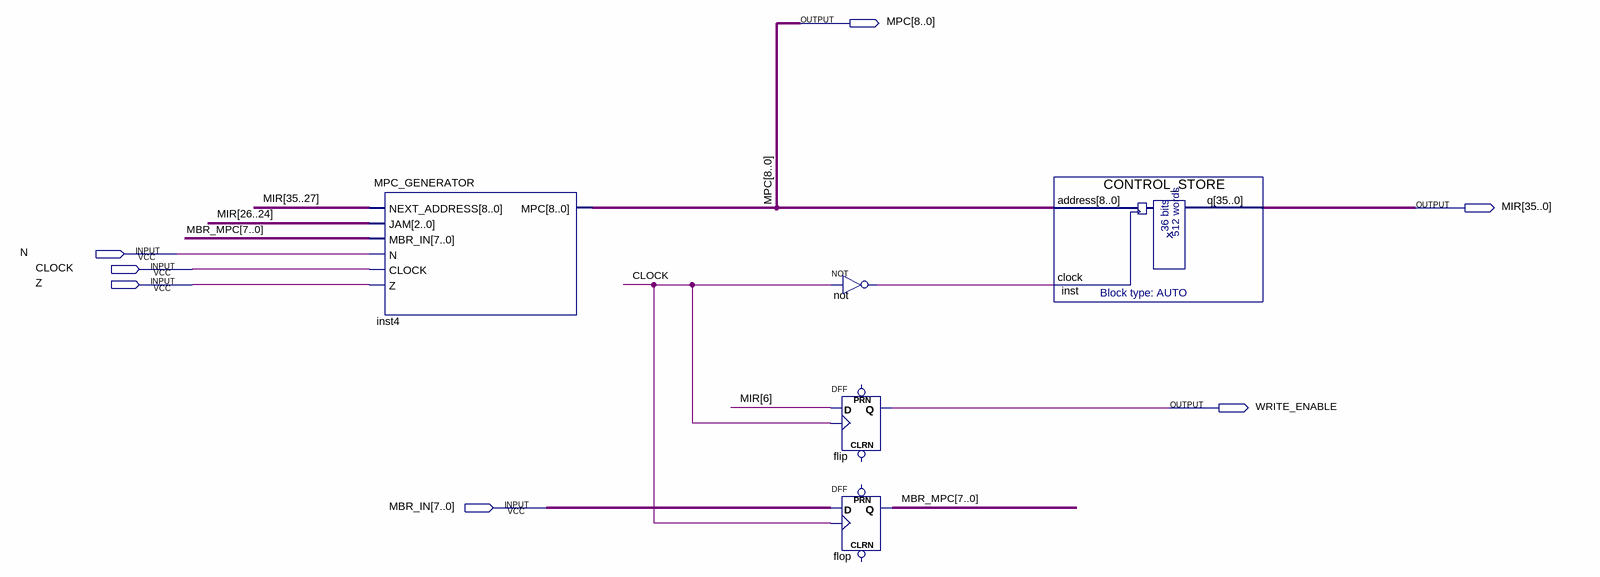
[diagram p0: schematic sheet]
// Quartus schematic CONTROL_UNIT.bdf as structural Verilog: 5 symbols, 7 pins
module CONTROL_UNIT (
  input  N,
  input  CLOCK,
  input  Z,
  input  [7:0] MBR_IN,
  output [8:0] MPC,
  output [35:0] MIR,
  output WRITE_ENABLE
);

  wire not_out;
  wire [7:0] MBR_MPC;

  MPC_GENERATOR inst4 (
    .NEXT_ADDRESS(MIR[35:27]), .JAM(MIR[26:24]), .MBR_IN(MBR_MPC), .N(N), .CLOCK(CLOCK), .Z(Z), .MPC(MPC));
  not \not  (not_out, CLOCK);
  DFF flip (.CLK(CLOCK), .D(MIR[6]), .Q(WRITE_ENABLE));  // open: CLRN, PRN
  DFF flop[7:0] (.CLK(CLOCK), .D(MBR_IN), .Q(MBR_MPC));  // open: CLRN, PRN
  CONTROL_STORE inst (.address(MPC), .clock(not_out), .q(MIR));
endmodule
